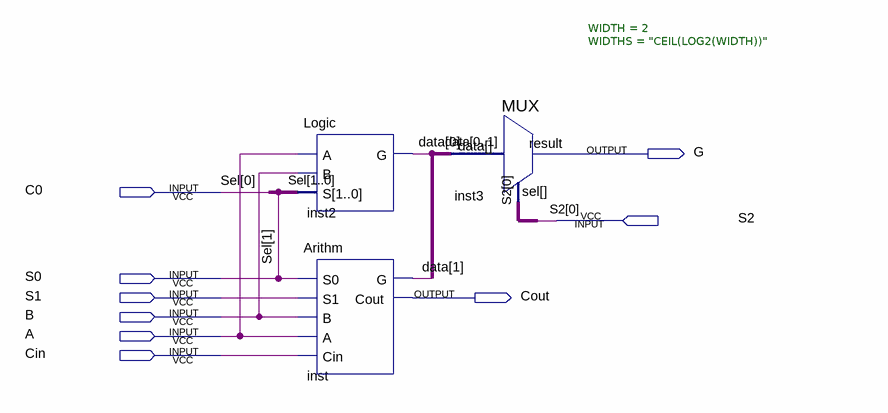
[diagram p0: schematic sheet]
// Quartus schematic ALU_1.bdf as structural Verilog: 3 symbols, 9 pins
module ALU_1 (
  input  C0,
  input  S2,
  input  S0,
  input  S1,
  input  B,
  input  A,
  input  Cin,
  output G,
  output Cout
);

  wire [1:0] data;

  Logic inst2 (.A(A), .B(B), .S({S0, C0}), .G(data[0]));
  Arithm inst (.S0(S0), .S1(S1), .B(B), .A(A), .Cin(Cin), .G(data[1]), .Cout(Cout));
  MUX #(.WIDTH(2), .WIDTHS("CEIL(LOG2(WIDTH))")) inst3 (.data({data[0], data[1]}), .sel(S2), .result(G));

  // Other names for the same wires on the sheet: Sel[1:0] = {S0, C0}; S2[0] = S2
endmodule
